# EAGLE schematic Schaltplan_Micromouse v12 (EAGLE 9.7.0)
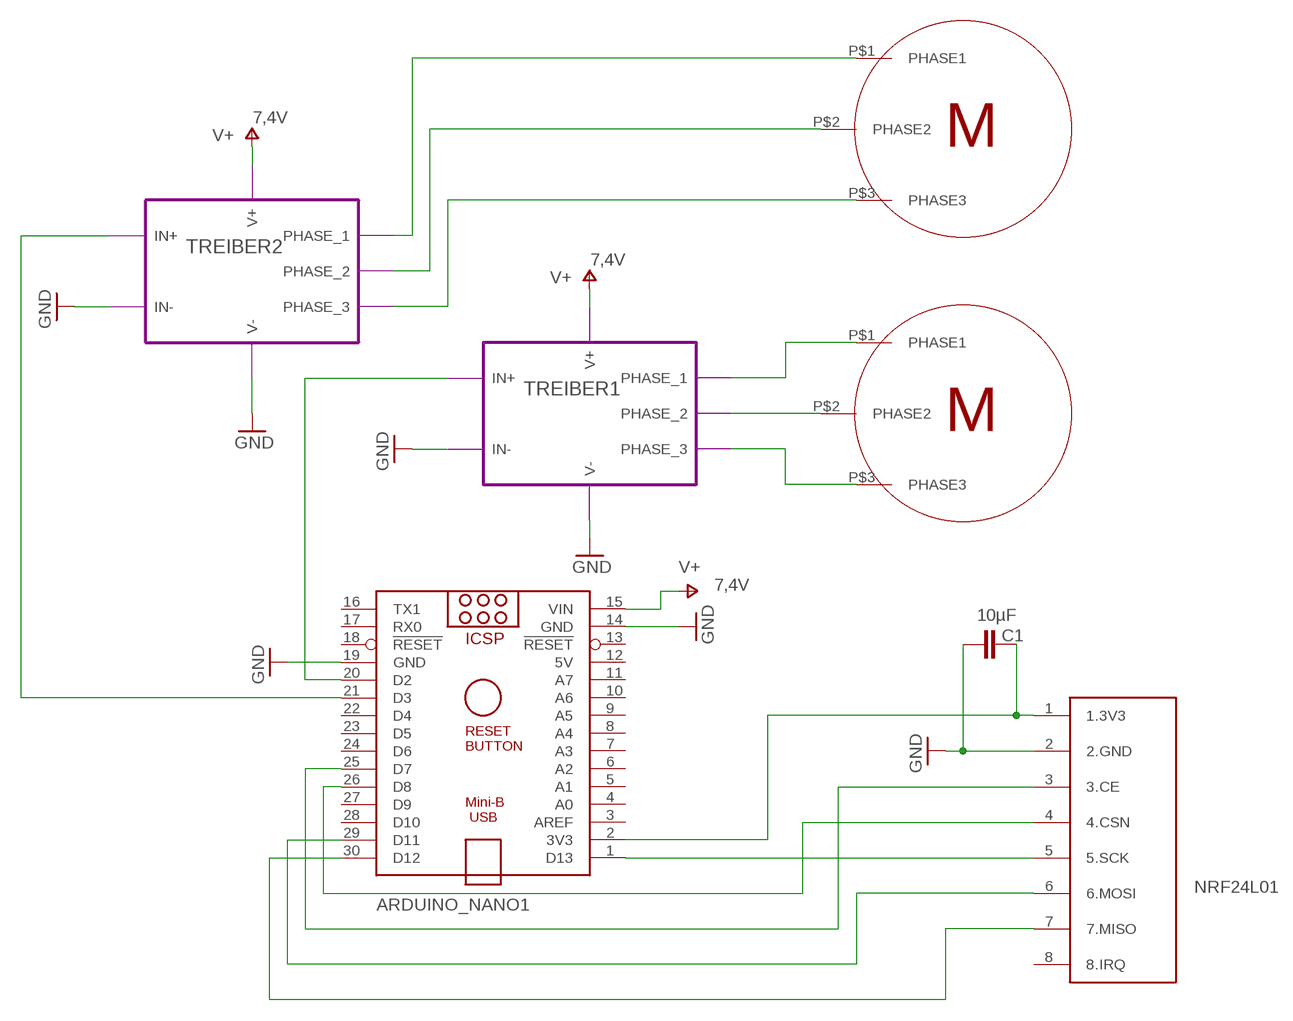
[diagram p0: schematic, sheet 1]

## Parts
ARDUINO_NANO1  ARDUINO_NANO  [ARDUINO_NANO]
C1  C-EU025-024X044  [C025-024X044]
NRF24L01  NRF24L01+  [NRF24L01+]
U$1  3-PHASEN-MOTOR  [3-PHASEN-MOTOR]
U$2  3-PHASEN-MOTOR  [3-PHASEN-MOTOR]

## Module instances
TREIBER1 = TREIBER
TREIBER2 = TREIBER

## Nets
GND: ARDUINO_NANO1.14(GND) ARDUINO_NANO1.19(GND) C1.1 NRF24L01.2(2.GND) ; port TREIBER1.V- TREIBER2.V- TREIBER1.IN- TREIBER2.IN-
N$1: ARDUINO_NANO1.2(3V3) C1.2 NRF24L01.1(1.3V3)
N$2: ARDUINO_NANO1.25(D7) NRF24L01.3(3.CE)
N$3: ARDUINO_NANO1.26(D8) NRF24L01.4(4.CSN)
N$4: ARDUINO_NANO1.1(D13) NRF24L01.5(5.SCK)
N$5: ARDUINO_NANO1.29(D11) NRF24L01.6(6.MOSI)
N$6: ARDUINO_NANO1.30(D12) NRF24L01.7(7.MISO)
N$7: ARDUINO_NANO1.20(D2) ; port TREIBER1.IN+
N$8: ARDUINO_NANO1.21(D3) ; port TREIBER2.IN+
N$9: U$1.P$1(PHASE1) ; port TREIBER1.PHASE_1
N$10: U$1.P$2(PHASE2) ; port TREIBER1.PHASE_2
N$11: U$1.P$3(PHASE3) ; port TREIBER1.PHASE_3
N$12: U$2.P$1(PHASE1) ; port TREIBER2.PHASE_1
N$13: U$2.P$2(PHASE2) ; port TREIBER2.PHASE_2
N$14: U$2.P$3(PHASE3) ; port TREIBER2.PHASE_3
V+: ARDUINO_NANO1.15(VIN) ; port TREIBER1.V+ TREIBER2.V+
Unconnected: ARDUINO_NANO1.3(AREF) ARDUINO_NANO1.4(A0) ARDUINO_NANO1.5(A1) ARDUINO_NANO1.6(A2) ARDUINO_NANO1.7(A3) ARDUINO_NANO1.8(A4) ARDUINO_NANO1.9(A5) ARDUINO_NANO1.10(A6) ARDUINO_NANO1.11(A7) ARDUINO_NANO1.13(!RESET) ARDUINO_NANO1.16(TX1) ARDUINO_NANO1.17(RX0) ARDUINO_NANO1.18(!RESET) ARDUINO_NANO1.22(D4) ARDUINO_NANO1.23(D5) ARDUINO_NANO1.24(D6) ARDUINO_NANO1.27(D9) ARDUINO_NANO1.28(D10) NRF24L01.8(8.IRQ)

## Power pins joined to a net without a drawn wire
5V: ARDUINO_NANO1.12(5V)

## Library data of the parts
ARDUINO_NANO1 = ArduinoNanoV30:ARDUINO_NANO: Arduino Nano V3.0 Overview: The Arduino Nano is a small, complete, and breadboard-friendly board based on the ATmega328 (Arduino Nano 3.x) or ATmega168 (Arduino Nano 2.x). It has more or less the same functionality of the Arduino Duemilanove, but in a different package. It lacks only a DC power jack, and works with a Mini-B USB cable instead of a standard one. The Nano was designed and is being produced by Gravitech. Specifications: Microcontroller Atmel ATmega168 or ATmega328 Operating Voltage (logic level) 5 V Input Voltage (recommended) 7-12 V Input Voltage (limits) 6-20 V Digital I/O Pins 14 (of which 6 provide PWM output) Analog Input Pins 8 DC Current per I/O Pin 40 mA Flash Memory 16 KB (ATmega168) or 32 KB (ATmega328) of which 2 KB used by bootloader SRAM 1 KB (ATmega168) or 2 KB (ATmega328) EEPROM 512 bytes (ATmega168) or 1 KB (ATmega328) Clock Speed 16 MHz Dimensions 0.73" x 1.70" Length 45 mm Width 18 mm Weigth 5 g Power: The Arduino Nano can be powered via the Mini-B USB connection, 6-20V unregulated external power supply (pin 30), or 5V regulated external power supply (pin 27). The power source is automatically selected to the highest voltage source. Memory: The ATmega168 has 16 KB of flash memory for storing code (of which 2 KB is used for the bootloader); the ATmega328 has 32 KB, (also with 2 KB used for the bootloader). The ATmega168 has 1 KB of SRAM and 512 bytes of EEPROM (which can be read and written with the EEPROM library); the ATmega328 has 2 KB of SRAM and 1 KB of EEPROM. Input and Output: Each of the 14 digital pins on the Nano can be used as an input or output, using pinMode(), digitalWrite(), and digitalRead() functions. They operate at 5 volts. Each pin can provide or receive a maximum of 40 mA and has an internal pull-up resistor (disconnected by default) of 20-50 kOhms. In addition, some pins have specialized functions. Visit Arduino - ArduinoBoardNano <https://www.arduino.cc/en/Main/ArduinoBoardNano>
C1 = rcl:C-EU: CAPACITOR, European symbol; SPICEPREFIX: C; WERT: 10µF
NRF24L01 = NRF24l01+:NRF24L01+; NRF24L01: 1
U$1 U$2 = Bibliothek_bürstenloser_Motor:3-PHASEN-MOTOR

## Module TREIBER
Ports: V+(io) V-(io) PHASE_1(io) PHASE_2(io) PHASE_3(io) IN+(io) IN-(io)

### Library data of the parts